# EAGLE schematic Controller (EAGLE 7.0.0)
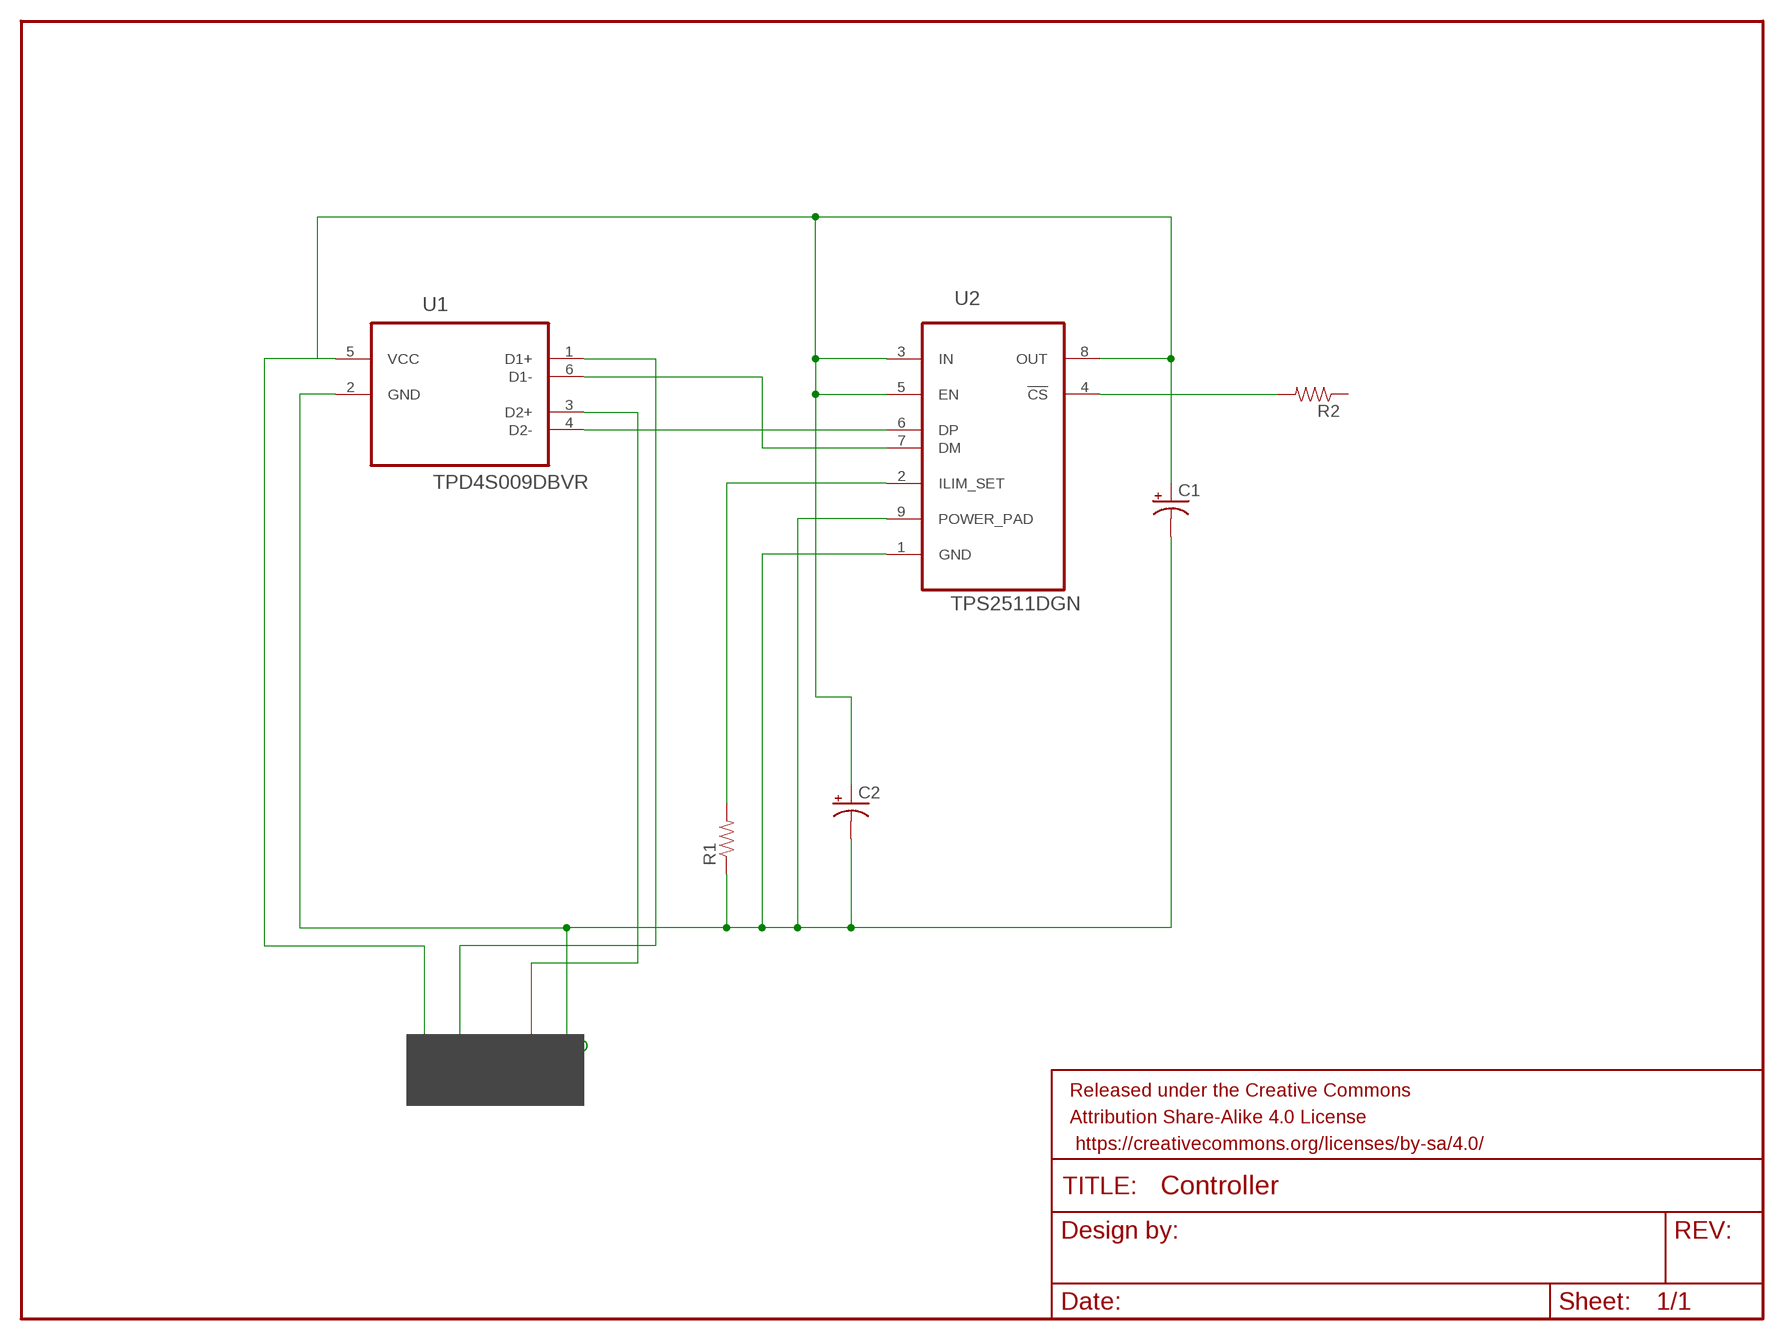
[diagram p0: schematic, sheet 1]

## Parts
C1  CPOL-USE2-5  [E2-5]
C2  CPOL-USE2-5  [E2-5]
FRAME1  FRAME-LETTER  [CREATIVE_COMMONS]
R1  RESISTORKIT  [AXIAL-0.3-KIT]
R2  RESISTORKIT  [AXIAL-0.3-KIT]
U1  TPD4S009DBVR  [SOT95P280X145-6N]
U2  TPS2511DGN  [SOP65P490X110-9N]

## Nets
N$1: U1.3(D2+)
N$2: U1.1(D1+)
N$3: C1.+ C2.+ U1.5(VCC) U2.3(IN) U2.5(EN) U2.8(OUT)
N$4: C1.- C2.- R1.P$1 U1.2(GND) U2.1(GND) U2.9(POWER_PAD)
N$5: U1.6(D1-) U2.7(DM)
N$6: U1.4(D2-) U2.6(DP)
N$7: R1.P$2 U2.2(ILIM_SET)
N$8: R2.P$2 U2.4(!CS)
Unconnected: R2.P$1

## Notes on the sheet
- VCC | DATA- | DATA+ | GND

## Library data of the parts
C1 C2 = adafruit:CPOL-US: POLARIZED CAPACITOR, American symbol
FRAME1 = SparkFun-Aesthetics:FRAME-LETTER: Schematic Frame Standard 8.5x11 US Letter frame
R1 R2 = SparkFun-Passives:RESISTOR: Resistor Basic schematic elements and footprints for 0603, 1206, and PTH resistors.
U1 = Texas Instruments_By_element14_Batch_1:TPD4S009DBVR: 4-CHANNEL ESD SOLUTION FOR HIGH-SPEED DIFFERENTIAL INTERFACE; MPN: TPD4S009DBVR; OC_FARNELL: 1855143; OC_NEWARK: 33R2191; PACKAGE: SOT-23-6; SUPPLIER: TEXAS INSTRUMENTS
U2 = TI-TPS2511DGN:TPS2511DGN: USB Dedicated Charging Port Controller,MSOP-8; MPN: TPS2511DGN; OC_FARNELL: 2211372; OC_NEWARK: 44W8612; PACKAGE: MSOP-8; SUPPLIER: TEXAS INSTRUMENTS